# Altium project USB_Switch_Board.PrjPcb
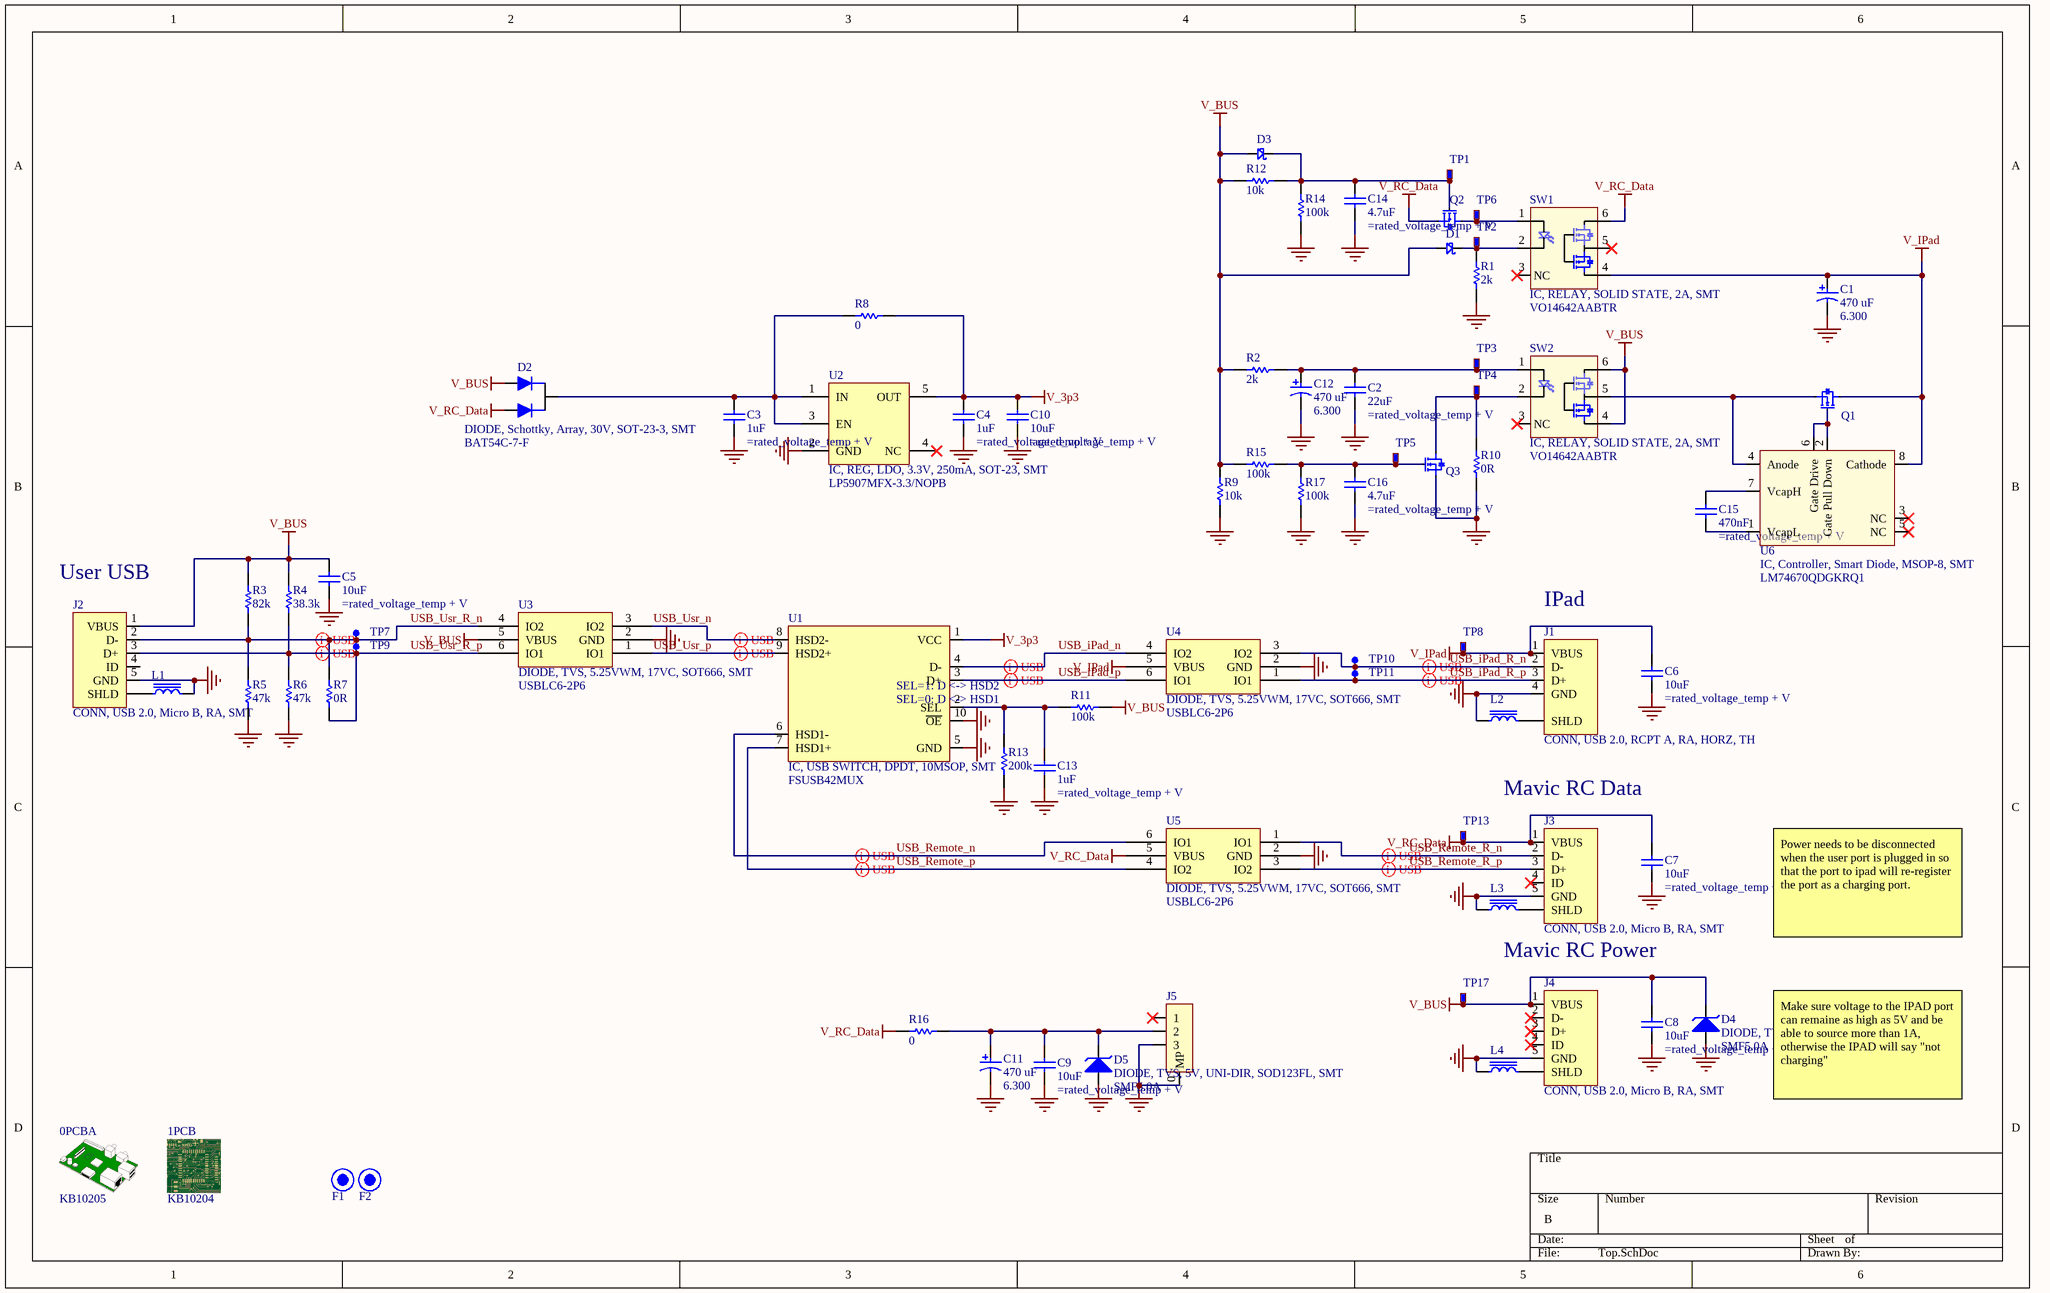
[diagram p0: Top.SchDoc]
Address1: 4005 Bohannon Dr.; Address2: Menlo Park, CA 94025; Company: Kespry; PCB_Approved_By: -; PCB_Approved_By_Date: --/--/--; PCB_Checked_By: -; PCB_Checked_By_Date: --/--/--; PCB_Copper_Weight_Inner: SEE STACKUP; PCB_Copper_Weight_Outer: SEE STACKUP; PCB_Drawn_By: Min Hsiao; PCB_Drawn_By_Date: --/--/--; PCB_Drill_Largest: -; PCB_Drill_Smallest: -; PCB_Drill_Total_Sizes: -; PCB_Dwg_Number: -; PCB_Finish_Plating: HASL; PCB_Impedance_controlled: No; PCB_Layer_Count: 2; PCB_Mask_Color: Black; PCB_Mask_Type: LPI; PCB_Material: FR4; PCB_Min_Space_Width: 6mil; PCB_Min_Trace_Width: 6mil; PCB_NPTH_TOLERANCE: +/- 3mil; PCB_Part_Number: KB10204; PCB_PTH_TOLERANCE: +3mil/-FHS; PCB_Released_By: -; PCB_Released_By_Date: --/--/--; PCB_Rev: 2; PCB_Silk_Bottom: WHITE EPOXY INK; PCB_Silk_Top: WHITE EPOXY INK; PCB_SMT_Min_Pad: -; PCB_SMT_Min_Pitch: -; PCB_Stackup: SEE BELOW; PCB_Thickness: 62mil; PCB_Title: PCB, USB Switch, IPad; PCBA_Part_Number: KB10205; PCBA_Rev: 2; PCBA_Title: PCBA, USB Switch, IPad
1 sheet, 75 parts. Net scope: global (net labels, ports and power ports of the same name join across sheets).
Board file: USB_Switch_Board.PcbDoc

## Sheet Top.SchDoc
size B

### Parts
0PCBA  item_number_custom: KB10205  (hidden comment: PCBA Schematic Symbol)
1PCB  item_number_custom: KB10204  (hidden comment: PCB Schematic Symbol)
C1  value 470 uF  Voltage: 6.300  [T520W477M006ATE035]  (hidden comment: CAP, 470uF, TANT POLY, 6.3V, ±20%, 2917, SMT)
C2  value 22uF  [CAPC1206(3216)190_L]  (hidden comment: CAP, 22uF, CER, 25V, X5R, ±20%, 1206, SMT)
C3  value 1uF  [CAPC0603(1608)100_L]  (hidden comment: CAP, 1uF, CER, 50V, X6S, ±10%, 0603, SMT)
C4  value 1uF  [CAPC0603(1608)100_L]  (hidden comment: CAP, 1uF, CER, 50V, X6S, ±10%, 0603, SMT)
C5  value 10uF  [CAPC0603(1608)100_L]  (hidden comment: CAP, 10uF, CER, 10V, X5R, ±10%, 0603, SMT)
C6  value 10uF  [CAPC0603(1608)100_L]  (hidden comment: CAP, 10uF, CER, 10V, X5R, ±10%, 0603, SMT)
C7  value 10uF  [CAPC0603(1608)100_L]  (hidden comment: CAP, 10uF, CER, 10V, X5R, ±10%, 0603, SMT)
C8  value 10uF  [CAPC0603(1608)100_L]  (hidden comment: CAP, 10uF, CER, 10V, X5R, ±10%, 0603, SMT)
C9  value 10uF  [CAPC0603(1608)100_L]  (hidden comment: CAP, 10uF, CER, 10V, X5R, ±10%, 0603, SMT)
C10  value 10uF  [CAPC0603(1608)100_L]  (hidden comment: CAP, 10uF, CER, 10V, X5R, ±10%, 0603, SMT)
C11  value 470 uF  Voltage: 6.300  [T520W477M006ATE035]  (hidden comment: CAP, 470uF, TANT POLY, 6.3V, ±20%, 2917, SMT)
C12  value 470 uF  Voltage: 6.300  [T520W477M006ATE035]  (hidden comment: CAP, 470uF, TANT POLY, 6.3V, ±20%, 2917, SMT)
C13  value 1uF  [CAPC0603(1608)100_N]  (hidden comment: CAP, 1uF, CER, 50V, X6S, ±10%, 0603, SMT)
C14  value 4.7uF  [CAPC0603(1608)100_L]  (hidden comment: CAP, 4.7uF, CER, 25V, X5R, ±10%, 0603, SMT)
C15  value 470nF  [CAPC0603(1608)100_L]  (hidden comment: CAP, 470nF, CER, 25V, X7R, ±10%, 0603, SMT)
C16  value 4.7uF  [CAPC0603(1608)100_L]  (hidden comment: CAP, 4.7uF, CER, 25V, X5R, ±10%, 0603, SMT)
D1  DIODE, Schottky, 45V, 0.1A, SOD323, SMT  [SOD323]  (value not drawn)
D2  Manufacturer_Part_Number1: BAT54C-7-F  [SOT-23-3]  (hidden comment: DIODE, Schottky, Array, 30V, SOT-23-3, SMT)
D3  DIODE, Schottky, 45V, 0.1A, SOD323, SMT  [SOD323]  (value not drawn)
D4  Manufacturer_Part_Number1: SMF5.0A  [SOD-123FL]  (hidden comment: DIODE, TVS, 5V, UNI-DIR, SOD123FL, SMT)
D5  Manufacturer_Part_Number1: SMF5.0A  [SOD-123FL]  (hidden comment: DIODE, TVS, 5V, UNI-DIR, SOD123FL, SMT)
F1  Fiducial  [FID0.6MM]  (value not drawn)  (no BOM)
F2  Fiducial  [FID0.6MM]  (value not drawn)  (no BOM)
J1  CONN, USB 2.0, RCPT A, RA, HORZ, TH  [UE27AC54100]
J2  CONN, USB 2.0, Micro B, RA, SMT  [10118194-0001LF]
J3  CONN, USB 2.0, Micro B, RA, SMT  [10118194-0001LF]
J4  CONN, USB 2.0, Micro B, RA, SMT  [10118194-0001LF]
J5  CONN, Header, 3-Pos, Shrouded, 1.25mm Pitch, RA, SMT  [0532610371]  (value not drawn)
L1  FERRITE, 80 OHM, 0402  [IND 1005 (0402)]  (value not drawn)
L2  FERRITE, 80 OHM, 0402  [IND 1005 (0402)]  (value not drawn)
L3  FERRITE, 80 OHM, 0402  [IND 1005 (0402)]  (value not drawn)
L4  FERRITE, 80 OHM, 0402  [IND 1005 (0402)]  (value not drawn)
Q1  MOSFET, N-CH, 30V, 6.2A, SOT23  [SOT-23-3]  (value not drawn)
Q2  MOSFET, P-CH, 60V, 180mA, SOT-23  [SOT-23-3]  (value not drawn)
Q3  MOSFET, N-CH, 30V, 6.2A, SOT23  [SOT-23-3]  (value not drawn)
R1  value 2k  [RESC0402(1005)_L]  (hidden comment: RES, 2K, 0.063W, 1%, 0402, SMT)
R2  value 2k  [RESC0402(1005)_L]  (hidden comment: RES, 2K, 0.063W, 1%, 0402, SMT)
R3  value 82k  [RESC0402(1005)_N]  (hidden comment: RES, 82K, 0.063W, 1%, 0402, SMT)
R4  value 38.3k  [RESC0402(1005)_N]  (hidden comment: RES, 38.3K OHM, 1%, 1/16W, 0402, SMD)
R5  value 47k  [RESC0402(1005)_N]  (hidden comment: RES, 47K OHM, 1%, 1/5W, 0402, SMD)
R6  value 47k  [RESC0402(1005)_N]  (hidden comment: RES, 47K OHM, 1%, 1/5W, 0402, SMD)
R7  value 0R  [RESC0402(1005)_N]  (hidden comment: RES, Jumper, 0R, 0.063W, 0402, SMT)
R8  value 0  [RESC0603(1608)_N]  (hidden comment: RES, 0, 0.1W, 1%, 0603, SMT)
R9  value 10k  [RESC0402(1005)_L]  (hidden comment: RES, 10K, 0.063W, 1%, 0402, SMT)
R10  value 0R  [RESC0402(1005)_L]  (hidden comment: RES, Jumper, 0R, 0.063W, 0402, SMT)
R11  value 100k  [RESC0402(1005)_L]  (hidden comment: RES, 100K, 0.063W, 1%, 0402, SMT)
R12  value 10k  [RESC0402(1005)_L]  (hidden comment: RES, 10K, 0.063W, 1%, 0402, SMT)
R13  value 200k  [RESC0402(1005)_N]  (hidden comment: RES, 200K, 0.063W, 1%, 0402, SMT)
R14  value 100k  [RESC0402(1005)_L]  (hidden comment: RES, 100K, 0.063W, 1%, 0402, SMT)
R15  value 100k  [RESC0402(1005)_L]  (hidden comment: RES, 100K, 0.063W, 1%, 0402, SMT)
R16  value 0  [RESC0603(1608)_N]  (hidden comment: RES, 0, 0.1W, 1%, 0603, SMT)
R17  value 100k  [RESC0402(1005)_L]  (hidden comment: RES, 100K, 0.063W, 1%, 0402, SMT)
SW1  IC, RELAY, SOLID STATE, 2A, SMT  [VO14642AABTR]
SW2  IC, RELAY, SOLID STATE, 2A, SMT  [VO14642AABTR]
TP1  TESTPOINT, 0603, SMT  [TP0603]  (value not drawn)
TP2  TESTPOINT, 0603, SMT  [TP0603]  (value not drawn)
TP3  TESTPOINT, 0603, SMT  [TP0603]  (value not drawn)
TP4  TESTPOINT, 0603, SMT  [TP0603]  (value not drawn)
TP5  TESTPOINT, 0603, SMT  [TP0603]  (value not drawn)
TP6  TESTPOINT, 0603, SMT  [TP0603]  (value not drawn)
TP7  TESTPOINT, 1mm Diam, Round  [TP1MM]  (value not drawn)  (no BOM)
TP8  TESTPOINT, 0603, SMT  [TP0603]  (value not drawn)
TP9  TESTPOINT, 1mm Diam, Round  [TP1MM]  (value not drawn)  (no BOM)
TP10  TESTPOINT, 1mm Diam, Round  [TP1MM]  (value not drawn)  (no BOM)
TP11  TESTPOINT, 1mm Diam, Round  [TP1MM]  (value not drawn)  (no BOM)
TP13  TESTPOINT, 0603, SMT  [TP0603]  (value not drawn)
TP17  TESTPOINT, 0603, SMT  [TP0603]  (value not drawn)
U1  IC, USB SWITCH, DPDT, 10MSOP, SMT  [MSOP10]
U2  Manufacturer_Part_Number1: LP5907MFX-3.3/NOPB  [DBV (SOT-23)]  (hidden comment: IC, REG, LDO, 3.3V, 250mA, SOT-23, SMT)
U3  DIODE, TVS, 5.25VWM, 17VC, SOT666, SMT  [SOT-666]
U4  DIODE, TVS, 5.25VWM, 17VC, SOT666, SMT  [SOT-666]
U5  DIODE, TVS, 5.25VWM, 17VC, SOT666, SMT  [SOT-666]
U6  Manufacturer_Part_Number1: LM74670QDGKRQ1  [MSOP8]  (hidden comment: IC, Controller, Smart Diode, MSOP-8, SMT)

### Nets
GND: C1.2 C2.2 C3.2 C4.2 C5.2 C6.2 C7.2 C8.2 C9.2 C10.2 C11.2 C12.2 C13.2 C14.2 C16.2 D4.2 D5.2 J1.4(GND) J2.5(GND) J3.5(GND) J4.5(GND) J5.0(MP) J5.3 L1.1 L2.1 L3.1 L4.1 Q3.2(S) R1.2 R5.1 R6.1 R9.2 R10.1 R13.1 R14.2 R17.2 U1.5(GND) U1.10(~{OE}) U2.2(GND) U3.2(GND) U4.2(GND) U5.2(GND)
V_3p3: C4.1 C10.1 R8.1 U1.1(VCC) U2.5(OUT)
V_BUS: C5.1 C8.1 D1.1 D2.1(A1) D3.1 D4.1 J2.1(VBUS) J4.1(VBUS) R2.1 R3.2 R4.2 R9.1 R11.2 R12.2 R15.1 SW2.4(S') SW2.6(S) TP17.1(TP) U3.5(VBUS)
V_IPad: C1.1 C6.1 J1.1(VBUS) Q1.3(D) SW1.4(S') TP8.1(TP) U4.5(VBUS) U6.8(Cathode)
V_RC_Data: C7.1 D2.2(A2) J3.1(VBUS) Q2.2(S) R16.1 SW1.6(S) TP13.1(TP) U5.5(VBUS)
USB_iPad_n: U1.4(D-) U4.4(IO2)
USB_iPad_p: U1.3(D+) U4.6(IO1)
USB_iPad_R_n: J1.2(D-) TP10.1 U4.3(IO2)
USB_iPad_R_p: J1.3(D+) TP11.1 U4.1(IO1)
USB_Remote_n: U1.6(HSD1-) U5.6(IO1)
USB_Remote_p: U1.7(HSD1+) U5.4(IO2)
USB_Remote_R_n: J3.2(D-) U5.1(IO1)
USB_Remote_R_p: J3.3(D+) U5.3(IO2)
USB_Usr_n: U1.8(HSD2-) U3.3(IO2)
USB_Usr_p: U1.9(HSD2+) U3.1(IO1)
USB_Usr_R_n: J2.2(D-) R3.1 R5.2 R7.2 TP7.1 U3.4(IO2)
USB_Usr_R_p: J2.3(D+) R4.1 R6.2 R7.1 TP9.1 U3.6(IO1)
NetC2_1: C2.1 C12.1 R2.2 SW2.1(Anode) TP3.1(TP)
NetC3_1: C3.1 D2.3(K) R8.2 U2.1(IN) U2.3(EN)
NetC9_1: C9.1 C11.1 D5.1 J5.2 R16.2
NetC13_1: C13.1 R11.1 R13.2 U1.2(SEL)
NetC14_1: C14.1 D3.2 Q2.1(G) R12.1 R14.1 TP1.1(TP)
NetC15_1: C15.1 U6.1(VcapL)
NetC15_2: C15.2 U6.7(VcapH)
NetC16_1: C16.1 Q3.1(G) R15.2 R17.1 TP5.1(TP)
NetD1_2: D1.2 R1.1 SW1.2(Cathode) TP2.1(TP)
NetJ1_0: J1.0(SHLD) L2.2
NetJ2_0: J2.0(SHLD) L1.2
NetJ3_0: J3.0(SHLD) L3.2
NetJ4_0: J4.0(SHLD) L4.2
NetQ1_1: Q1.1(G) U6.2(Gate_Pull_Down) U6.6(Gate_Drive)
NetQ1_2: Q1.2(S) SW2.5(DC) U6.4(Anode)
NetQ2_3: Q2.3(D) SW1.1(Anode) TP6.1(TP)
NetQ3_3: Q3.3(D) R10.2 SW2.2(Cathode) TP4.1(TP)

Not connected (* = marked no-connect by the designer): J2 4(ID); J3 4(ID)*; J4 2(D-)* 3(D+)* 4(ID)*; J5 1*; SW1 3(NC)* 5(DC)*; SW2 3(NC)*; U2 4(NC)*; U6 3(NC)* 5(NC)*

### Layout directives
differential pair: USB_iPad_n, USB_iPad_p, USB_iPad_R_n, USB_iPad_R_p, USB_Remote_n, USB_Remote_p, USB_Remote_R_n, USB_Remote_R_p, USB_Usr_n, USB_Usr_p, USB_Usr_R_n, USB_Usr_R_p

### Notes on the sheet
- (near J2) User USB
- (near J1) IPad
- Mavic RC Data
- Mavic RC Power
- Power needs to be disconnected when the user port is plugged in so that the port to ipad will re-register the port as a charging port.
- Make sure voltage to the IPAD port can remaine as high as 5V and be able to source more than 1A, otherwise the IPAD will say "not charging"
- (in symbol KH10970) SEL=1: D <-> HSD2; SEL=0: D <-> HSD1

### Library data of the parts
0PCBA = KH10554: Used for importing Altium BOMs.; Part_Type: Misc Electrical; Item_Phase: Preliminary; SchLibComponentName: PCBA; Part_Name: PCBA Schematic Symbol; Part_Number: KH10554; Revision: A; Specs_View: https://app.bom.com/a/GYHNX4N4N65DLQX3?v=spec.summary; Bom_View: https://app.bom.com/a/GYHNX4N4N65DLQX3?v=bom.indented; Sourcing_View: https://app.bom.com/a/GYHNX4N4N65DLQX3?v=sourcing.relationships; Costing_View: https://app.bom.com/a/GYHNX4N4N65DLQX3?v=costing.summary; Files_View: https://app.bom.com/a/GYHNX4N4N65DLQX3?v=files.associations
1PCB = KH10553: Used for importing Altium BOMs.; Part_Type: Misc Electrical; Item_Phase: Preliminary; SchLibComponentName: PCB; Part_Name: PCB Schematic Symbol; Part_Number: KH10553; Revision: A; Specs_View: https://app.bom.com/a/N5OU4BUBUDCKSXFC?v=spec.summary; Bom_View: https://app.bom.com/a/N5OU4BUBUDCKSXFC?v=bom.indented; Sourcing_View: https://app.bom.com/a/N5OU4BUBUDCKSXFC?v=sourcing.relationships; Costing_View: https://app.bom.com/a/N5OU4BUBUDCKSXFC?v=costing.summary; Files_View: https://app.bom.com/a/N5OU4BUBUDCKSXFC?v=files.associations
C1 C11 C12 = KH10972: Part_Type: Capacitor; Manufacturer1: KEMET; Item_Phase: Preliminary; Capacitance (Unit Value): uF 470; ESR (Unit Value): mOhm 35; Tolerance (+/-%): 20; Type (Capacitor): Tantalum; SchLibComponentName: CAP_POL; Part_Name: CAP, 470uF, TANT POLY, 6.3V, ±20%, 2917, SMT; Part_Number: KH10972; Manufacturer_Part_Number1: T520W477M006ATE035; Distributor1: Digi-Key; Distributor_Part_Number1: 399-11982-6-ND; Specs_View: https://app.bom.com/a/VDW2CJ2J2LKCPUI4?v=spec.summary; Bom_View: https://app.bom.com/a/VDW2CJ2J2LKCPUI4?v=bom.indented; Sourcing_View: https://app.bom.com/a/VDW2CJ2J2LKCPUI4?v=sourcing.relationships; Costing_View: https://app.bom.com/a/VDW2CJ2J2LKCPUI4?v=costing.summary; Files_View: https://app.bom.com/a/VDW2CJ2J2LKCPUI4?v=files.associations; Height (mm): 1.500; Mounting Technology: Surface Mount (SMT); Package: 2917
C2 = KH10501: ...; Part_Type: Capacitor; Manufacturer1: TDK Corporation; Manufacturer_Part_Number1: C3216X5R1E226M160AB; Voltage: 25.000; Item_Phase: Production; Capacitance (Unit Value): uF 22; Tolerance (+/-%): 20; Type (Capacitor): Ceramic; SchLibComponentName: CAP; rated_voltage_temp: =Voltage + 0; Rated Voltage: =rated_voltage_temp + V; Part_Name: CAP, 22uF, CER, 25V, X5R, ±20%, 1206, SMT; Part_Number: KH10501; Revision: 1; Specs_View: https://app.bom.com/a/XFY4EL4L4NMU28VA?v=spec.summary; Bom_View: https://app.bom.com/a/XFY4EL4L4NMU28VA?v=bom.indented; Sourcing_View: https://app.bom.com/a/XFY4EL4L4NMU28VA?v=sourcing.relationships; Costing_View: https://app.bom.com/a/XFY4EL4L4NMU28VA?v=costing.summary; Files_View: https://app.bom.com/a/XFY4EL4L4NMU28VA?v=files.associations; Current (Unit Value): CAP; Mounting Technology: Surface Mount (SMT); Package: 1206
C3 C4 C13 = KH10492: ...; Part_Type: Capacitor; Manufacturer1: TDK Corporation; Manufacturer_Part_Number1: C1608X6S1H105K080AC; Voltage: 50.000; Item_Phase: Production; Capacitance (Unit Value): uF 1; Tolerance (+/-%): 10; Type (Capacitor): Ceramic; SchLibComponentName: CAP; rated_voltage_temp: =Voltage + 0; Rated Voltage: =rated_voltage_temp + V; Part_Name: CAP, 1uF, CER, 50V, X6S, ±10%, 0603, SMT; Part_Number: KH10492; Revision: 1; Specs_View: https://app.bom.com/a/O6PV5CVCVEDLTZME?v=spec.summary; Bom_View: https://app.bom.com/a/O6PV5CVCVEDLTZME?v=bom.indented; Sourcing_View: https://app.bom.com/a/O6PV5CVCVEDLTZME?v=sourcing.relationships; Costing_View: https://app.bom.com/a/O6PV5CVCVEDLTZME?v=costing.summary; Files_View: https://app.bom.com/a/O6PV5CVCVEDLTZME?v=files.associations; Current (Unit Value): CAP; Mounting Technology: Surface Mount (SMT); Package: 0603
C5-C10 = KH10478: ...; Part_Type: Capacitor; Manufacturer1: Yageo; Manufacturer_Part_Number1: C1608X5R1A106K080AC; Voltage: 10.000; Item_Phase: Production; Capacitance (Unit Value): uF 10; Tolerance (+/-%): 10; Type (Capacitor): Ceramic; SchLibComponentName: CAP; rated_voltage_temp: =Voltage + 0; Rated Voltage: =rated_voltage_temp + V; Part_Name: CAP, 10uF, CER, 10V, X5R, ±10%, 0603, SMT; Part_Number: KH10478; Revision: 1; Specs_View: https://app.bom.com/a/ASBHRYHYH0Z7FL9M?v=spec.summary; Bom_View: https://app.bom.com/a/ASBHRYHYH0Z7FL9M?v=bom.indented; Sourcing_View: https://app.bom.com/a/ASBHRYHYH0Z7FL9M?v=sourcing.relationships; Costing_View: https://app.bom.com/a/ASBHRYHYH0Z7FL9M?v=costing.summary; Files_View: https://app.bom.com/a/ASBHRYHYH0Z7FL9M?v=files.associations; Current (Unit Value): CAP; Mounting Technology: Surface Mount (SMT); Package: 0603
C14 C16 = KH10511: ...; Part_Type: Capacitor; Manufacturer1: Murata Electronics North America; Manufacturer_Part_Number1: GRM188R61E475KE11D; Voltage: 25.000; Item_Phase: Production; Capacitance (Unit Value): uF 4.7; Tolerance (+/-%): 10; Type (Capacitor): Ceramic; SchLibComponentName: CAP; rated_voltage_temp: =Voltage + 0; Rated Voltage: =rated_voltage_temp + V; Part_Name: CAP, 4.7uF, CER, 25V, X5R, ±10%, 0603, SMT; Part_Number: KH10511; Revision: 1; Specs_View: https://app.bom.com/a/8Q9FPWFWFYX5DJ6S?v=spec.summary; Bom_View: https://app.bom.com/a/8Q9FPWFWFYX5DJ6S?v=bom.indented; Sourcing_View: https://app.bom.com/a/8Q9FPWFWFYX5DJ6S?v=sourcing.relationships; Costing_View: https://app.bom.com/a/8Q9FPWFWFYX5DJ6S?v=costing.summary; Files_View: https://app.bom.com/a/8Q9FPWFWFYX5DJ6S?v=files.associations; Current (Unit Value): CAP; Mounting Technology: Surface Mount (SMT); Package: 0603
C15 = KH10515: ...; Part_Type: Capacitor; Manufacturer1: AVX; Manufacturer_Part_Number1: 06033C474KAT2A; Voltage: 25.000; Item_Phase: Production; Capacitance (Unit Value): nF 470; Tolerance (+/-%): 10; Type (Capacitor): Ceramic; SchLibComponentName: CAP; rated_voltage_temp: =Voltage + 0; Rated Voltage: =rated_voltage_temp + V; Part_Name: CAP, 470nF, CER, 25V, X7R, ±10%, 0603, SMT; Part_Number: KH10515; Revision: 1; Specs_View: https://app.bom.com/a/CUDJT0J0J219HNA3?v=spec.summary; Bom_View: https://app.bom.com/a/CUDJT0J0J219HNA3?v=bom.indented; Sourcing_View: https://app.bom.com/a/CUDJT0J0J219HNA3?v=sourcing.relationships; Costing_View: https://app.bom.com/a/CUDJT0J0J219HNA3?v=costing.summary; Files_View: https://app.bom.com/a/CUDJT0J0J219HNA3?v=files.associations; Current (Unit Value): CAP; Mounting Technology: Surface Mount (SMT); Package: 0603
D1 D3 = KH10397: ..; Manufacturer_Part_Number1: SDM10K45-7-F; Manufacturer1: Diodes Incorporated; Item_Phase: Production; Current (Unit Value): mA 100; Voltage - Forward (V): 0.450; Voltage - Reverse (V): 45.000; SchLibComponentName: DIODE_SCHOTTKY; Part_Name: DIODE, Schottky, 45V, 0.1A, SOD323, SMT; Part_Number: KH10397; Part_Type: Diode; Revision: 1; Specs_View: https://app.bom.com/a/0I17HO7O7QPX5B11?v=spec.summary; Bom_View: https://app.bom.com/a/0I17HO7O7QPX5B11?v=bom.indented; Sourcing_View: https://app.bom.com/a/0I17HO7O7QPX5B11?v=sourcing.relationships; Costing_View: https://app.bom.com/a/0I17HO7O7QPX5B11?v=costing.summary; Files_View: https://app.bom.com/a/0I17HO7O7QPX5B11?v=files.associations; Mounting Technology: Surface Mount (SMT); Type (Diode): Schottky
D2 = KH10976: Manufacturer1: Diodes Incorporated; SchLibComponentName: SS8P6C-M3/86A; Item_Phase: Preliminary; Current (Unit Value): mA 200; Voltage - Forward (V): 0.800; Voltage - Reverse (V): 30.000; Part_Name: DIODE, Schottky, Array, 30V, SOT-23-3, SMT; Part_Number: KH10976; Part_Type: Diode; Distributor1: Digi-Key; Distributor_Part_Number1: BAT54C-FDIDKR-ND; Specs_View: https://app.bom.com/a/GYHNX4N4N65XJOXB?v=spec.summary; Bom_View: https://app.bom.com/a/GYHNX4N4N65XJOXB?v=bom.indented; Sourcing_View: https://app.bom.com/a/GYHNX4N4N65XJOXB?v=sourcing.relationships; Costing_View: https://app.bom.com/a/GYHNX4N4N65XJOXB?v=costing.summary; Files_View: https://app.bom.com/a/GYHNX4N4N65XJOXB?v=files.associations; Height (mm): 1.200; Mounting Technology: Surface Mount (SMT); Package: SOT-23-3; Type (Diode): Schottky
D4 D5 = KH10968: Manufacturer1: Littlefuse Inc.; SchLibComponentName: DIODE_TVS; Item_Phase: Preliminary; Part_Name: DIODE, TVS, 5V, UNI-DIR, SOD123FL, SMT; Part_Number: KH10968; Part_Type: Diode; Distributor1: Digi-Key; Distributor_Part_Number1: F5748DKR-ND; Specs_View: https://app.bom.com/a/I0JPZ6P6P87ZHEEI?v=spec.summary; Bom_View: https://app.bom.com/a/I0JPZ6P6P87ZHEEI?v=bom.indented; Sourcing_View: https://app.bom.com/a/I0JPZ6P6P87ZHEEI?v=sourcing.relationships; Costing_View: https://app.bom.com/a/I0JPZ6P6P87ZHEEI?v=costing.summary; Files_View: https://app.bom.com/a/I0JPZ6P6P87ZHEEI?v=files.associations; Mounting Technology: Surface Mount (SMT); Package: SOD-123FL; Type (Diode): TVS; Value: 5V
F1 F2 = KH10246: ...; Part_Type: Misc Electrical; Item_Phase: Preliminary; SchLibComponentName: FID; Part_Name: Fiducial; Part_Number: KH10246; Revision: A; Specs_View: https://app.bom.com/a/UCV1BI1I1KJRZ5ZW?v=spec.summary; Bom_View: https://app.bom.com/a/UCV1BI1I1KJRZ5ZW?v=bom.indented; Sourcing_View: https://app.bom.com/a/UCV1BI1I1KJRZ5ZW?v=sourcing.relationships; Costing_View: https://app.bom.com/a/UCV1BI1I1KJRZ5ZW?v=costing.summary; Files_View: https://app.bom.com/a/UCV1BI1I1KJRZ5ZW?v=files.associations; Mounting Technology: Other
J1 = KH10969: Part_Type: Connector; Manufacturer1: Amphenol Commercial Products; Item_Phase: Preliminary; Conductors: 4; Locking: No; Shielded: Yes; Type (Connector): USB 2.0 A; SchLibComponentName: USB_Type_A; Part_Name: CONN, USB 2.0, RCPT A, RA, HORZ, TH; Part_Number: KH10969; Manufacturer_Part_Number1: UE27AC54100; Distributor1: Digi-Key; Distributor_Part_Number1: UE27AC54100-ND; Specs_View: https://app.bom.com/a/CUDJT0J0J21TB7WD?v=spec.summary; Bom_View: https://app.bom.com/a/CUDJT0J0J21TB7WD?v=bom.indented; Sourcing_View: https://app.bom.com/a/CUDJT0J0J21TB7WD?v=sourcing.relationships; Costing_View: https://app.bom.com/a/CUDJT0J0J21TB7WD?v=costing.summary; Files_View: https://app.bom.com/a/CUDJT0J0J21TB7WD?v=files.associations; Height (mm): 7.200; Mounting Technology: Through Hole
J2-J4 = KH10298: .; Part_Type: Connector; Manufacturer1: Amphenol; Item_Phase: Production; Conductors: 5; Locking: No; Rows: 1; Shielded: Yes; Type (Connector): USB 2.0 Micro B; SchLibComponentName: 10118194-0001LF; Part_Name: CONN, USB 2.0, Micro B, RA, SMT; Part_Number: KH10298; Revision: 1; Manufacturer_Part_Number1: 10118194-0001LF; Specs_View: https://app.bom.com/a/BTCISZIZI108GMFO?v=spec.summary; Bom_View: https://app.bom.com/a/BTCISZIZI108GMFO?v=bom.indented; Sourcing_View: https://app.bom.com/a/BTCISZIZI108GMFO?v=sourcing.relationships; Costing_View: https://app.bom.com/a/BTCISZIZI108GMFO?v=costing.summary; Files_View: https://app.bom.com/a/BTCISZIZI108GMFO?v=files.associations; Mounting Technology: Surface Mount (SMT)
J5 = KH10793: Part_Type: Connector; Item_Phase: Preliminary; Conductors: 3; Locking: No; Pin Pitch (mm): 1.25; Plating Material: Tin; SchLibComponentName: CONN3; Part_Name: CONN, Header, 3-Pos, Shrouded, 1.25mm Pitch, RA, SMT; Part_Number: KH10793; Specs_View: https://app.bom.com/a/0I17HO7O7QPTCBT2?v=spec.summary; Bom_View: https://app.bom.com/a/0I17HO7O7QPTCBT2?v=bom.indented; Sourcing_View: https://app.bom.com/a/0I17HO7O7QPTCBT2?v=sourcing.relationships; Costing_View: https://app.bom.com/a/0I17HO7O7QPTCBT2?v=costing.summary; Files_View: https://app.bom.com/a/0I17HO7O7QPTCBT2?v=files.associations; Height (mm): 3.400; Mounting Technology: Surface Mount (SMT); Type (Connector): Header
L1-L4 = KH10117: ..; Part_Type: Inductor; Manufacturer1: Murata Electronics North America; Manufacturer_Part_Number1: BLM15PX800SN1D; Item_Phase: Production; SchLibComponentName: FERRITE; Part_Name: FERRITE, 80 OHM, 0402; Part_Number: KH10117; Revision: 1; Specs_View: https://app.bom.com/a/3L4AKRARATS08DVL?v=spec.summary; Bom_View: https://app.bom.com/a/3L4AKRARATS08DVL?v=bom.indented; Sourcing_View: https://app.bom.com/a/3L4AKRARATS08DVL?v=sourcing.relationships; Costing_View: https://app.bom.com/a/3L4AKRARATS08DVL?v=costing.summary; Files_View: https://app.bom.com/a/3L4AKRARATS08DVL?v=files.associations; Inductance (Unit Value): N/A; Mounting Technology: Surface Mount (SMT); Type (Inductor): Ferrite
Q1 Q3 = KH10792: Part_Type: Transistor; Manufacturer1: Diodes Incorporated; Manufacturer_Part_Number1: DMN3023L-7; Item_Phase: Production; Current (Unit Value): A 6.3; Type (Transistor): FET (N-CH); SchLibComponentName: NFET; Part_Number: KH10792; Part_Name: MOSFET, N-CH, 30V, 6.2A, SOT23; Revision: 1; Distributor1: Digi-Key; Distributor_Part_Number1: DMN3023L-7DIDKR-ND; Specs_View: https://app.bom.com/a/CUDJT0J0J215OOBA?v=spec.summary; Bom_View: https://app.bom.com/a/CUDJT0J0J215OOBA?v=bom.indented; Sourcing_View: https://app.bom.com/a/CUDJT0J0J215OOBA?v=sourcing.relationships; Costing_View: https://app.bom.com/a/CUDJT0J0J215OOBA?v=costing.summary; Files_View: https://app.bom.com/a/CUDJT0J0J215OOBA?v=files.associations; Height (mm): 1.200; Mounting Technology: Surface Mount (SMT); Package: SOT23
Q2 = KH10356: ..; Part_Type: Transistor; Manufacturer1: Fairchild Semiconductor; Manufacturer_Part_Number1: NDS0605; Item_Phase: Production; Type (Transistor): FET (P-CH); SchLibComponentName: PFET; Part_Number: KH10356; Part_Name: MOSFET, P-CH, 60V, 180mA, SOT-23; Revision: 1; Specs_View: https://app.bom.com/a/XFY4EL4L4NMU28ZE?v=spec.summary; Bom_View: https://app.bom.com/a/XFY4EL4L4NMU28ZE?v=bom.indented; Sourcing_View: https://app.bom.com/a/XFY4EL4L4NMU28ZE?v=sourcing.relationships; Costing_View: https://app.bom.com/a/XFY4EL4L4NMU28ZE?v=costing.summary; Files_View: https://app.bom.com/a/XFY4EL4L4NMU28ZE?v=files.associations; Mounting Technology: Surface Mount (SMT)
R1 R2 = KH10444: . .; Part_Type: Resistor; Manufacturer1: Vishay; Manufacturer_Part_Number1: CRCW04022K00FKED; Item_Phase: Production; Power (Unit Value): mW 63; Resistance (Unit Value): k 2; Tolerance (+/-%): 1; Type (Resistor): Standard; SchLibComponentName: RES; Part_Number: KH10444; Part_Name: RES, 2K, 0.063W, 1%, 0402, SMT; Revision: 1; Manufacturer2: Vishay; Manufacturer_Part_Number2: CRCW04022K00FKEE; Specs_View: https://app.bom.com/a/CUDJT0J0J219HNC5?v=spec.summary; Bom_View: https://app.bom.com/a/CUDJT0J0J219HNC5?v=bom.indented; Sourcing_View: https://app.bom.com/a/CUDJT0J0J219HNC5?v=sourcing.relationships; Costing_View: https://app.bom.com/a/CUDJT0J0J219HNC5?v=costing.summary; Files_View: https://app.bom.com/a/CUDJT0J0J219HNC5?v=files.associations; Mounting Technology: Surface Mount (SMT); Package: 0402
R3 = KH10891: Part_Type: Resistor; Manufacturer1: Vishay Dale; Manufacturer_Part_Number1: CRCW040282K0FKED; Item_Phase: Production; Prod_Cost: .0056; Power (Unit Value): m 63; Resistance (Unit Value): k 82; Tolerance (+/-%): 1; Type (Resistor): Standard; SchLibComponentName: RES; Part_Number: KH10891; Part_Name: RES, 82K, 0.063W, 1%, 0402, SMT; Revision: 1; Distributor1: Digi-Key; Distributor_Part_Number1: 541-82.0KLDKR-ND; Manufacturer2: Yageo; Manufacturer_Part_Number2: RC0402FR-0782KL; Distributor2: Digi-Key; Distributor_Part_Number2: 311-82.0KLRCT-ND; Specs_View: https://app.bom.com/a/FXGMW3M3M543Y0NF?v=spec.summary; Bom_View: https://app.bom.com/a/FXGMW3M3M543Y0NF?v=bom.indented; Sourcing_View: https://app.bom.com/a/FXGMW3M3M543Y0NF?v=sourcing.relationships; Costing_View: https://app.bom.com/a/FXGMW3M3M543Y0NF?v=costing.summary; Files_View: https://app.bom.com/a/FXGMW3M3M543Y0NF?v=files.associations; Mounting Technology: Surface Mount (SMT); Package: 0402
R4 = KH10977: Part_Type: Resistor; Manufacturer1: Yageo; Manufacturer_Part_Number1: RC0402FR-0738K3L; Item_Phase: Preliminary; Power (Unit Value): W 1/16; Resistance (Unit Value): kOhm 38.3; Tolerance (+/-%): 1; Type (Resistor): Standard; SchLibComponentName: RES; Part_Number: KH10977; Part_Name: RES, 38.3K OHM, 1%, 1/16W, 0402, SMD; Distributor1: Digi-Key; Distributor_Part_Number1: YAG3141DKR-ND; Specs_View: https://app.bom.com/a/8Q9FPWFWFYXPBGDJ?v=spec.summary; Bom_View: https://app.bom.com/a/8Q9FPWFWFYXPBGDJ?v=bom.indented; Sourcing_View: https://app.bom.com/a/8Q9FPWFWFYXPBGDJ?v=sourcing.relationships; Costing_View: https://app.bom.com/a/8Q9FPWFWFYXPBGDJ?v=costing.summary; Files_View: https://app.bom.com/a/8Q9FPWFWFYXPBGDJ?v=files.associations; Height (mm): 0.400; Mounting Technology: Surface Mount (SMT); Package: 0402
R5 R6 = KH10805: .; Part_Type: Resistor; Manufacturer1: Vishay Dale; Manufacturer_Part_Number1: CRCW040247K0FKEDHP; Item_Phase: Production; Power (Unit Value): W 1/5; Resistance (Unit Value): kOhm 47; Tolerance (+/-%): 1; Type (Resistor): Standard; SchLibComponentName: RES; Part_Number: KH10805; Part_Name: RES, 47K OHM, 1%, 1/5W, 0402, SMD; Revision: 1; Distributor1: Digi-Key; Distributor_Part_Number1: 541-47.0KYCT-ND; Specs_View: https://app.bom.com/a/SATZ9GZGZIHLRHV6?v=spec.summary; Bom_View: https://app.bom.com/a/SATZ9GZGZIHLRHV6?v=bom.indented; Sourcing_View: https://app.bom.com/a/SATZ9GZGZIHLRHV6?v=sourcing.relationships; Costing_View: https://app.bom.com/a/SATZ9GZGZIHLRHV6?v=costing.summary; Files_View: https://app.bom.com/a/SATZ9GZGZIHLRHV6?v=files.associations; Height (mm): 0.400; Mounting Technology: Surface Mount (SMT); Package: 0402
R7 R10 = KH10412: .; Part_Type: Resistor; Manufacturer1: Samsung Electro-Mechanics; Manufacturer_Part_Number1: RC1005J000CS; Item_Phase: Production; Power (Unit Value): mW 63; Resistance (Unit Value): R 0; SchLibComponentName: RES; Part_Number: KH10412; Part_Name: RES, Jumper, 0R, 0.063W, 0402, SMT; Revision: 2; Distributor1: Digi-Key; Distributor_Part_Number1: 1276-3480-1-ND; Manufacturer2: Yageo; Manufacturer_Part_Number2: RC0402JR-070RL; Distributor2: Digi-Key; Distributor_Part_Number2: 311-0.0JRCT-ND; Specs_View: https://app.bom.com/a/FXGMW3M3M54CKQGV?v=spec.summary; Bom_View: https://app.bom.com/a/FXGMW3M3M54CKQGV?v=bom.indented; Sourcing_View: https://app.bom.com/a/FXGMW3M3M54CKQGV?v=sourcing.relationships; Costing_View: https://app.bom.com/a/FXGMW3M3M54CKQGV?v=costing.summary; Files_View: https://app.bom.com/a/FXGMW3M3M54CKQGV?v=files.associations; Mounting Technology: Surface Mount (SMT); Package: 0402; Type (Resistor): Jumper
R8 = KH10965: Part_Type: Resistor; Manufacturer1: Panasonic Electronic Components; Manufacturer_Part_Number1: ERJ-3GEY0R00V; Item_Phase: Design; Power (Unit Value): W 0.1; Resistance (Unit Value): Ohm 0; Type (Resistor): Jumper; SchLibComponentName: RES; Part_Number: KH10965; Part_Name: RES, 0, 0.1W, 1%, 0603, SMT; Revision: A; Distributor1: Digi-Key; Distributor_Part_Number1: P0.0GDKR-ND; Specs_View: https://app.bom.com/a/WEX3DK3K3MLE4SN7?v=spec.summary; Bom_View: https://app.bom.com/a/WEX3DK3K3MLE4SN7?v=bom.indented; Sourcing_View: https://app.bom.com/a/WEX3DK3K3MLE4SN7?v=sourcing.relationships; Costing_View: https://app.bom.com/a/WEX3DK3K3MLE4SN7?v=costing.summary; Files_View: https://app.bom.com/a/WEX3DK3K3MLE4SN7?v=files.associations; Mounting Technology: Surface Mount (SMT); Package: 0603
R9 R12 = KH10420: . .; Part_Type: Resistor; Manufacturer1: Panasonic; Manufacturer_Part_Number1: ERJ-2RKF1002X; Item_Phase: Production; Power (Unit Value): mW 63; Resistance (Unit Value): k 10; Tolerance (+/-%): 1; Type (Resistor): Standard; SchLibComponentName: RES; Part_Number: KH10420; Part_Name: RES, 10K, 0.063W, 1%, 0402, SMT; Revision: 1; Manufacturer2: Vishay; Manufacturer_Part_Number2: CRCW040210K0FKED; Specs_View: https://app.bom.com/a/O6PV5CVCVEDLTZOG?v=spec.summary; Bom_View: https://app.bom.com/a/O6PV5CVCVEDLTZOG?v=bom.indented; Sourcing_View: https://app.bom.com/a/O6PV5CVCVEDLTZOG?v=sourcing.relationships; Costing_View: https://app.bom.com/a/O6PV5CVCVEDLTZOG?v=costing.summary; Files_View: https://app.bom.com/a/O6PV5CVCVEDLTZOG?v=files.associations; Mounting Technology: Surface Mount (SMT); Package: 0402
R11 R14 R15 R17 = KH10416: . .; Part_Type: Resistor; Manufacturer1: Panasonic; Manufacturer_Part_Number1: ERJ-2RKF1003X; Item_Phase: Production; Power (Unit Value): mW 63; Resistance (Unit Value): k 100; Tolerance (+/-%): 1; Type (Resistor): Standard; SchLibComponentName: RES; Part_Number: KH10416; Part_Name: RES, 100K, 0.063W, 1%, 0402, SMT; Revision: 1; Manufacturer2: Vishay; Manufacturer_Part_Number2: CRCW0402100KFKED; Specs_View: https://app.bom.com/a/K2LR18R8RA9HPVKH?v=spec.summary; Bom_View: https://app.bom.com/a/K2LR18R8RA9HPVKH?v=bom.indented; Sourcing_View: https://app.bom.com/a/K2LR18R8RA9HPVKH?v=sourcing.relationships; Costing_View: https://app.bom.com/a/K2LR18R8RA9HPVKH?v=costing.summary; Files_View: https://app.bom.com/a/K2LR18R8RA9HPVKH?v=files.associations; Mounting Technology: Surface Mount (SMT); Package: 0402
R13 = KH10438: . .; Part_Type: Resistor; Manufacturer1: Vishay; Manufacturer_Part_Number1: CRCW0402200KFKED; Item_Phase: Production; Power (Unit Value): mW 63; Resistance (Unit Value): k 200; Tolerance (+/-%): 1; Type (Resistor): Standard; SchLibComponentName: RES; Part_Number: KH10438; Part_Name: RES, 200K, 0.063W, 1%, 0402, SMT; Revision: 1; Manufacturer2: Yageo; Manufacturer_Part_Number2: RC0402FR-07200KL; Specs_View: https://app.bom.com/a/6O7DNUDUDWV3BH6N?v=spec.summary; Bom_View: https://app.bom.com/a/6O7DNUDUDWV3BH6N?v=bom.indented; Sourcing_View: https://app.bom.com/a/6O7DNUDUDWV3BH6N?v=sourcing.relationships; Costing_View: https://app.bom.com/a/6O7DNUDUDWV3BH6N?v=costing.summary; Files_View: https://app.bom.com/a/6O7DNUDUDWV3BH6N?v=files.associations; Mounting Technology: Surface Mount (SMT); Package: 0402
R16 = KH10965: Part_Type: Resistor; Manufacturer1: Panasonic Electronic Components; Manufacturer_Part_Number1: ERJ-3GEY0R00V; Item_Phase: Preliminary; Power (Unit Value): W 0.1; Resistance (Unit Value): Ohm 0; Type (Resistor): Jumper; SchLibComponentName: RES; Part_Number: KH10965; Part_Name: RES, 0, 0.1W, 1%, 0603, SMT; Distributor1: Digi-Key; Distributor_Part_Number1: P0.0GDKR-ND; Specs_View: https://app.bom.com/a/WEX3DK3K3MLE4SN7?v=spec.summary; Bom_View: https://app.bom.com/a/WEX3DK3K3MLE4SN7?v=bom.indented; Sourcing_View: https://app.bom.com/a/WEX3DK3K3MLE4SN7?v=sourcing.relationships; Costing_View: https://app.bom.com/a/WEX3DK3K3MLE4SN7?v=costing.summary; Files_View: https://app.bom.com/a/WEX3DK3K3MLE4SN7?v=files.associations; Mounting Technology: Surface Mount (SMT); Package: 0603
SW1 SW2 = KH10967: Manufacturer1: Vishay Dale; SchLibComponentName: NFET; Item_Phase: Preliminary; Type (IC): Power; Part_Name: IC, RELAY, SOLID STATE, 2A, SMT; Part_Number: KH10967; Manufacturer_Part_Number1: VO14642AABTR; Part_Type: IC; Distributor1: Digi-Key; Distributor_Part_Number1: VO14642AABDKR-ND; Specs_View: https://app.bom.com/a/EWFLV2L2L43WK0UD?v=spec.summary; Bom_View: https://app.bom.com/a/EWFLV2L2L43WK0UD?v=bom.indented; Sourcing_View: https://app.bom.com/a/EWFLV2L2L43WK0UD?v=sourcing.relationships; Costing_View: https://app.bom.com/a/EWFLV2L2L43WK0UD?v=costing.summary; Files_View: https://app.bom.com/a/EWFLV2L2L43WK0UD?v=files.associations; Mounting Technology: Surface Mount (SMT); Power (Unit Value): VO14642AABTR
TP1-TP6 TP8 TP13 TP17 = KH10245: ..; Part_Type: Misc Electrical; Manufacturer1: TE Connectivity; Manufacturer_Part_Number1: RCU-0C; Item_Phase: Production; SchLibComponentName: TP_RECT; Part_Name: TESTPOINT, 0603, SMT; Part_Number: KH10245; Revision: 1; Specs_View: https://app.bom.com/a/TBU0AH0H0JIQY4YI?v=spec.summary; Bom_View: https://app.bom.com/a/TBU0AH0H0JIQY4YI?v=bom.indented; Sourcing_View: https://app.bom.com/a/TBU0AH0H0JIQY4YI?v=sourcing.relationships; Costing_View: https://app.bom.com/a/TBU0AH0H0JIQY4YI?v=costing.summary; Files_View: https://app.bom.com/a/TBU0AH0H0JIQY4YI?v=files.associations; Mounting Technology: Surface Mount (SMT)
TP7 TP9-TP11 = KH10379: ...; Part_Type: Misc Electrical; Item_Phase: Preliminary; SchLibComponentName: TP; Part_Name: TESTPOINT, 1mm Diam, Round; Part_Number: KH10379; Revision: A; Specs_View: https://app.bom.com/a/L3MS29S9SBAIQWMP?v=spec.summary; Bom_View: https://app.bom.com/a/L3MS29S9SBAIQWMP?v=bom.indented; Sourcing_View: https://app.bom.com/a/L3MS29S9SBAIQWMP?v=sourcing.relationships; Costing_View: https://app.bom.com/a/L3MS29S9SBAIQWMP?v=costing.summary; Files_View: https://app.bom.com/a/L3MS29S9SBAIQWMP?v=files.associations; Mounting Technology: Other
U1 = KH10970: Manufacturer1: On Semiconductor; SchLibComponentName: FSUSB42UMX; Item_Phase: Preliminary; Type (IC): Other Digital; Part_Name: IC, USB SWITCH, DPDT, 10MSOP, SMT; Part_Number: KH10970; Manufacturer_Part_Number1: FSUSB42MUX; Part_Type: IC; Distributor1: Digi-Key; Distributor_Part_Number1: FSUSB42MUXDKR-ND; Specs_View: https://app.bom.com/a/CUDJT0J0J21TB6ZH?v=spec.summary; Bom_View: https://app.bom.com/a/CUDJT0J0J21TB6ZH?v=bom.indented; Sourcing_View: https://app.bom.com/a/CUDJT0J0J21TB6ZH?v=sourcing.relationships; Costing_View: https://app.bom.com/a/CUDJT0J0J21TB6ZH?v=costing.summary; Files_View: https://app.bom.com/a/CUDJT0J0J21TB6ZH?v=files.associations; Height (mm): 1.200; Mounting Technology: Surface Mount (SMT); Package: 10MSOP
U2 = KH10237: ..; Manufacturer1: Texas Instruments; Item_Phase: Production; Type (IC): Power; SchLibComponentName: LP5907MFX-3.3; Part_Name: IC, REG, LDO, 3.3V, 250mA, SOT-23, SMT; Part_Number: KH10237; Part_Type: IC; Revision: 1; Specs_View: https://app.bom.com/a/L3MS29S9SBAIQWQT?v=spec.summary; Bom_View: https://app.bom.com/a/L3MS29S9SBAIQWQT?v=bom.indented; Sourcing_View: https://app.bom.com/a/L3MS29S9SBAIQWQT?v=sourcing.relationships; Costing_View: https://app.bom.com/a/L3MS29S9SBAIQWQT?v=costing.summary; Files_View: https://app.bom.com/a/L3MS29S9SBAIQWQT?v=files.associations; Mounting Technology: Surface Mount (SMT)
U3-U5 = KH10130: ..; Manufacturer1: STMicroelectronics; Item_Phase: Production; Voltage - Reverse (V): 5.250; SchLibComponentName: USBLC6-2P6; Part_Name: DIODE, TVS, 5.25VWM, 17VC, SOT666, SMT; Part_Number: KH10130; Manufacturer_Part_Number1: USBLC6-2P6; Part_Type: Diode; Revision: 1; Distributor1: Digi-Key; Distributor_Part_Number1: 497-5026-1-ND; Specs_View: https://app.bom.com/a/SATZ9GZGZIHPX30P?v=spec.summary; Bom_View: https://app.bom.com/a/SATZ9GZGZIHPX30P?v=bom.indented; Sourcing_View: https://app.bom.com/a/SATZ9GZGZIHPX30P?v=sourcing.relationships; Costing_View: https://app.bom.com/a/SATZ9GZGZIHPX30P?v=costing.summary; Files_View: https://app.bom.com/a/SATZ9GZGZIHPX30P?v=files.associations; Mounting Technology: Surface Mount (SMT); Type (Diode): TVS
U6 = KH10944: Manufacturer1: Texas Instruments; SchLibComponentName: ESC_BUCKLESS; Item_Phase: Preliminary; Pin Pitch (mm): 0.65; Type (IC): Other Analog; Part_Name: IC, Controller, Smart Diode, MSOP-8, SMT; Part_Number: KH10944; Part_Type: IC; Distributor1: Digi-Key; Distributor_Part_Number1: 296-43171-6-ND; Specs_View: https://app.bom.com/a/9RAGQXGXGZYTFY41?v=spec.summary; Bom_View: https://app.bom.com/a/9RAGQXGXGZYTFY41?v=bom.indented; Sourcing_View: https://app.bom.com/a/9RAGQXGXGZYTFY41?v=sourcing.relationships; Costing_View: https://app.bom.com/a/9RAGQXGXGZYTFY41?v=costing.summary; Files_View: https://app.bom.com/a/9RAGQXGXGZYTFY41?v=files.associations; Height (mm): 1.100; Mounting Technology: Surface Mount (SMT); Package: MSOP8

## Assembly variants
Standard: not fitted C1 C2 C11 C12 C13 F1 F2 R7 R8 R9 R10 R12 TP1 TP2 TP3 TP4 TP5 TP6 TP7 TP8 TP9 TP10 TP11 TP13 TP17